# Altium schematic sheet COMMUNICATION.SchDoc
size 420 x 297 mm; SheetNumber: 3; SheetTotal: 4
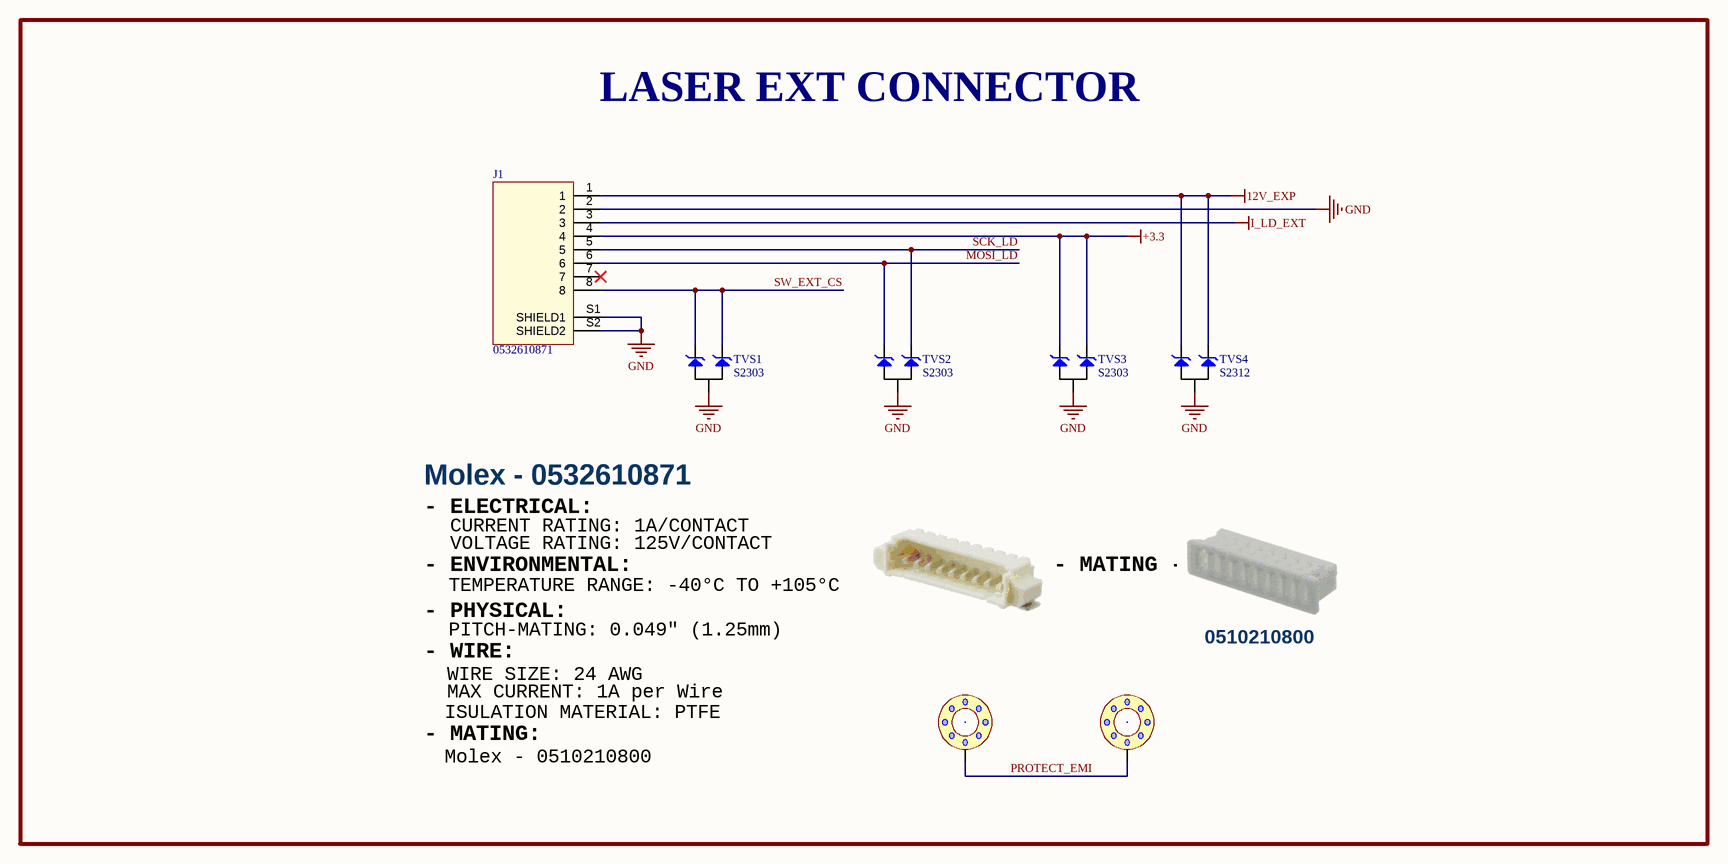
[diagram p0: COMMUNICATION.SchDoc]

## Parts
Hole1  Hole  [Hole space]  (value not drawn)
Hole2  Hole  [Hole space]  (value not drawn)
J1  0532610871  [0532610871]
TVS1  S2303  [SOT23-123]
TVS2  S2303  [SOT23-123]
TVS3  S2303  [SOT23-123]
TVS4  S2312  [SOT23-123]

## Nets
12V_EXP: J1.1 TVS4.1 TVS4.3
+3.3: J1.4 TVS3.1 TVS3.3
GND: J1.2 J1.S1(SHIELD1) J1.S2(SHIELD2) TVS1.2 TVS2.2 TVS3.2 TVS4.2
I_LD_EXT: J1.3
MOSI_LD: J1.6 TVS2.3
PROTECT_EMI: Hole1.1 Hole2.1
SCK_LD: J1.5 TVS2.1
SW_EXT_CS: J1.8 TVS1.1 TVS1.3

Not connected (* = marked no-connect by the designer): J1 7*

## Notes on the sheet
- LASER EXT CONNECTOR
- Molex - 0532610871
- - ELECTRICAL:
- CURRENT RATING: 1A/CONTACT
- - ENVIRONMENTAL:
- TEMPERATURE RANGE: -40°C TO +105°C
- VOLTAGE RATING: 125V/CONTACT
- - MATING -
- - PHYSICAL:
- - WIRE:
- PITCH-MATING: 0.049" (1.25mm)
- 0510210800
- ISULATION MATERIAL: PTFE
- WIRE SIZE: 24 AWG
- MAX CURRENT: 1A per Wire
- - MATING:
- Molex - 0510210800
- Project:
- Sub-system:
- SATELLITE_EXP_CONTROLLER
- Design by:
- Sheet title:
- Sheet
- A3
- of
- Checked by:
- Approved by:
- Revision:
- Document No:
- Size:
- Date:

## Library data of the parts
J1 = Header8 - Shield: CONN HEADER SMD R/A 8POS 1.25MM
TVS1-TVS3 = S2303: TVS DIODE 3.3VWM 8VC SOT233
TVS4 = S2315: TVS DIODE 12VWM 19VC SOT233